# Altium schematic sheet ShutdownDPDT-S04-V00-RelayGroup.SchDoc
size A3; SheetNumber: 2; SheetTotal: 3
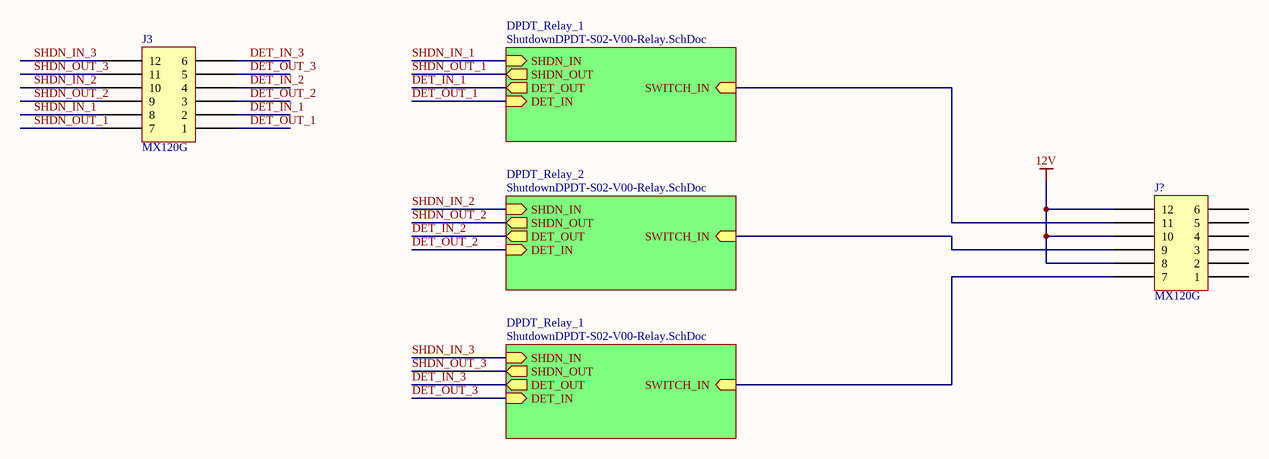
[diagram p0: ShutdownDPDT-S04-V00-RelayGroup.SchDoc]

## Parts
J3  MX120G  [MX120G]
J?  MX120G  [MX120G]

## Sub-sheets
DPDT_Relay_1 = ShutdownDPDT-S02-V00-Relay.SchDoc: SWITCH_IN (in), SHDN_IN (in), SHDN_OUT (out), DET_OUT (out), DET_IN (in)
DPDT_Relay_1 = ShutdownDPDT-S02-V00-Relay.SchDoc: SWITCH_IN (in), SHDN_IN (in), SHDN_OUT (out), DET_OUT (out), DET_IN (in)
DPDT_Relay_2 = ShutdownDPDT-S02-V00-Relay.SchDoc: SWITCH_IN (in), SHDN_IN (in), SHDN_OUT (out), DET_OUT (out), DET_IN (in)

## Nets
12V: J?.8 J?.10 J?.12
DET_IN_1: J3.2 ; sheet DPDT_Relay_1/DET_OUT
DET_IN_2: J3.4 ; sheet DPDT_Relay_2/DET_OUT
DET_IN_3: J3.6 ; sheet DPDT_Relay_1/DET_OUT
DET_OUT_1: J3.1 ; sheet DPDT_Relay_1/DET_IN
DET_OUT_2: J3.3 ; sheet DPDT_Relay_2/DET_IN
DET_OUT_3: J3.5 ; sheet DPDT_Relay_1/DET_IN
SHDN_IN_1: J3.8 ; sheet DPDT_Relay_1/SHDN_IN
SHDN_IN_2: J3.10 ; sheet DPDT_Relay_2/SHDN_IN
SHDN_IN_3: J3.12 ; sheet DPDT_Relay_1/SHDN_IN
SHDN_OUT_1: J3.7 ; sheet DPDT_Relay_1/SHDN_OUT
SHDN_OUT_2: J3.9 ; sheet DPDT_Relay_2/SHDN_OUT
SHDN_OUT_3: J3.11 ; sheet DPDT_Relay_1/SHDN_OUT
NetJ?_7: J?.7 ; sheet DPDT_Relay_1/SWITCH_IN
NetJ?_9: J?.9 ; sheet DPDT_Relay_2/SWITCH_IN
NetJ?_11: J?.11 ; sheet DPDT_Relay_1/SWITCH_IN

Not connected (* = marked no-connect by the designer): J? 1 2 3 4 5 6

## Library data of the parts
J3 J? = MX120G: MX120G with standard connector layout